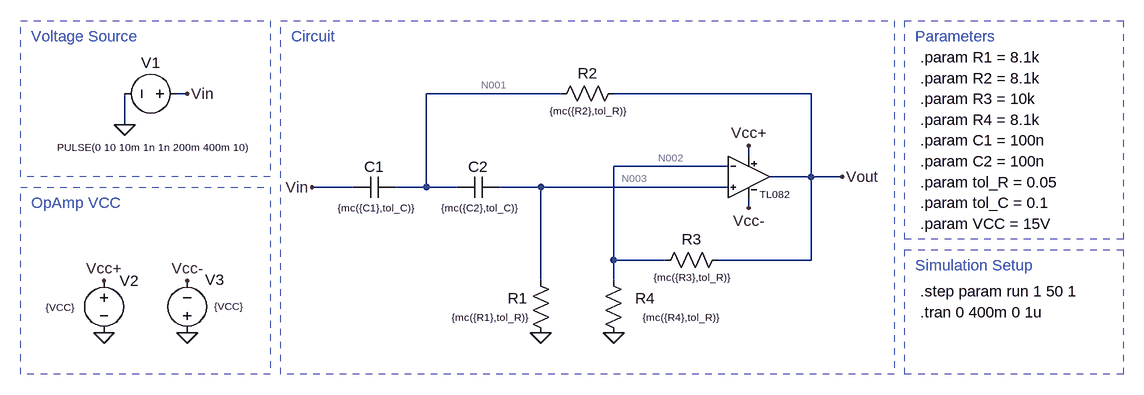
[diagram p0: schematic Simulacion_Analisis_de_Montecarlo.asc]
Simulacion_Analisis_de_Montecarlo.asc, the LTspice schematic file:
Version 4
SHEET 1 880 680
WIRE -704 -144 -720 -144
WIRE -128 -144 -336 -144
WIRE 256 -144 -48 -144
WIRE -800 -96 -800 -144
WIRE 160 -48 160 -64
WIRE 128 -32 -48 -32
WIRE 256 -16 256 -144
WIRE 256 -16 192 -16
WIRE 304 -16 256 -16
WIRE -448 0 -512 0
WIRE -336 0 -336 -144
WIRE -336 0 -384 0
WIRE -288 0 -336 0
WIRE -160 0 -224 0
WIRE 128 0 -160 0
WIRE 160 32 160 16
WIRE -48 112 -48 -32
WIRE 32 112 -48 112
WIRE 256 112 256 -16
WIRE 256 112 112 112
WIRE -160 144 -160 0
WIRE -48 144 -48 112
FLAG -800 -96 0
FLAG -832 224 0
FLAG -704 -144 Vin
FLAG -512 0 Vin
FLAG -832 144 Vcc+
FLAG 160 -64 Vcc+
FLAG -704 224 0
FLAG -704 144 Vcc-
FLAG 160 32 Vcc-
FLAG 304 -16 Vout
FLAG -160 224 0
FLAG -48 224 0
SYMBOL AutoGenerated\\TL082 160 -16 R0
WINDOW 0 17 27 Left 1
SYMATTR InstName TL082
SYMBOL voltage -704 -144 R90
WINDOW 0 -32 56 VBottom 2
WINDOW 3 72 56 VTop 1
SYMATTR InstName V1
SYMATTR Value PULSE(0 10 10m 1n 1n 200m 400m 10)
SYMBOL voltage -832 128 R0
WINDOW 3 -90 57 Left 1
SYMATTR InstName V2
SYMATTR Value {VCC}
SYMBOL res 128 96 R90
WINDOW 0 0 56 VBottom 2
WINDOW 3 32 56 VTop 1
SYMATTR InstName R3
SYMATTR Value {mc({R3},tol_R)}
SYMBOL res -32 -160 R90
WINDOW 0 0 56 VBottom 2
WINDOW 3 32 56 VTop 1
SYMATTR InstName R2
SYMATTR Value {mc({R2},tol_R)}
SYMBOL res -144 240 R180
WINDOW 0 36 69 Left 2
WINDOW 3 36 40 Left 1
SYMATTR InstName R1
SYMATTR Value {mc({R1},tol_R)}
SYMBOL res -32 240 R180
WINDOW 0 -48 69 Left 2
WINDOW 3 -146 40 Left 1
SYMATTR InstName R4
SYMATTR Value {mc({R4},tol_R)}
SYMBOL cap -384 -16 R90
WINDOW 0 0 32 VBottom 2
WINDOW 3 37 30 VTop 1
SYMATTR InstName C1
SYMATTR Value {mc({C1},tol_C)}
SYMBOL cap -224 -16 R90
WINDOW 0 0 32 VBottom 2
WINDOW 3 37 31 VTop 1
SYMATTR InstName C2
SYMATTR Value {mc({C2},tol_C)}
SYMBOL voltage -704 240 R180
WINDOW 0 -57 98 Left 2
WINDOW 3 -86 57 Left 1
SYMATTR InstName V3
SYMATTR Value {VCC}
TEXT -944 -232 Left 2 ;Voltage Source
TEXT -544 -232 Left 2 ;Circuit
TEXT 416 -232 Left 2 ;Parameters
TEXT 416 120 Left 2 ;Simulation Setup
TEXT 424 -200 Left 2 !.param R1 = 8.1k
TEXT 424 -168 Left 2 !.param R2 = 8.1k
TEXT 424 -136 Left 2 !.param R3 = 10k
TEXT 424 -104 Left 2 !.param R4 = 8.1k
TEXT 424 -72 Left 2 !.param C1 = 100n
TEXT 424 -40 Left 2 !.param C2 = 100n
TEXT 424 -8 Left 2 !.param tol_R = 0.05
TEXT 424 24 Left 2 !.param tol_C = 0.1
TEXT 424 56 Left 2 !.param VCC = 15V
TEXT -944 24 Left 2 ;OpAmp VCC
TEXT 424 160 Left 2 !.step param run 1 50 1
TEXT 424 192 Left 2 !.tran 0 400m 0 1u
RECTANGLE Normal -576 -16 -960 -256 2
RECTANGLE Normal 384 288 -560 -256 2
RECTANGLE Normal 736 80 400 -256 2
RECTANGLE Normal 736 288 400 96 2
RECTANGLE Normal -576 288 -960 0 2

The netlist it stands for:
* Simulacion_Analisis_de_Montecarlo.asc
XTL082 N003 N002 Vcc+ Vcc- Vout TL082  ; pins In+ In- V+ V- OUT
V1 Vin 0 PULSE(0 10 10m 1n 1n 200m 400m 10)
V2 Vcc+ 0 {VCC}
R3 Vout N002 {mc({R3},tol_R)}
R2 Vout N001 {mc({R2},tol_R)}
R1 0 N003 {mc({R1},tol_R)}
R4 0 N002 {mc({R4},tol_R)}
C1 N001 Vin {mc({C1},tol_C)}
C2 N003 N001 {mc({C2},tol_C)}
V3 0 Vcc- {VCC}
* Voltage Source
* Circuit
* Parameters
* Simulation Setup
.param R1 = 8.1k
.param R2 = 8.1k
.param R3 = 10k
.param R4 = 8.1k
.param C1 = 100n
.param C2 = 100n
.param tol_R = 0.05
.param tol_C = 0.1
.param VCC = 15V
* OpAmp VCC
.step param run 1 50 1
.tran 0 400m 0 1u
.lib C:\Users\beade\Documents\ITBA\ELECTROTECNIA\tp_final_electrotecnia\Altium\op_amp_301file\TL082.301
.backanno
.end

* Results of the author's LTspice run, read from the files saved beside the schematic
* Operating Point (first step), zero values left out:
*   run = 1 
*   V(vout) = 23.13 µV
*   V(vcc-) = -15 V
*   V(vcc+) = 15 V
*   V(n002) = 10.62 µV
*   V(n003) = -353.7 nV
*   V(n001) = 23.13 µV
*   I(R3) = 1.317 nA
*   I(R1) = 45.05 pA
*   I(R4) = -1.271 nA
*   I(V2) = -14.19 mA
*   I(V3) = -14.19 mA
*   Ix(tl082:1) = 45.05 pA
*   Ix(tl082:2) = 45.05 pA
*   Ix(tl082:3) = 14.19 mA
*   Ix(tl082:4) = -14.19 mA
*   Ix(tl082:5) = -1.317 nA